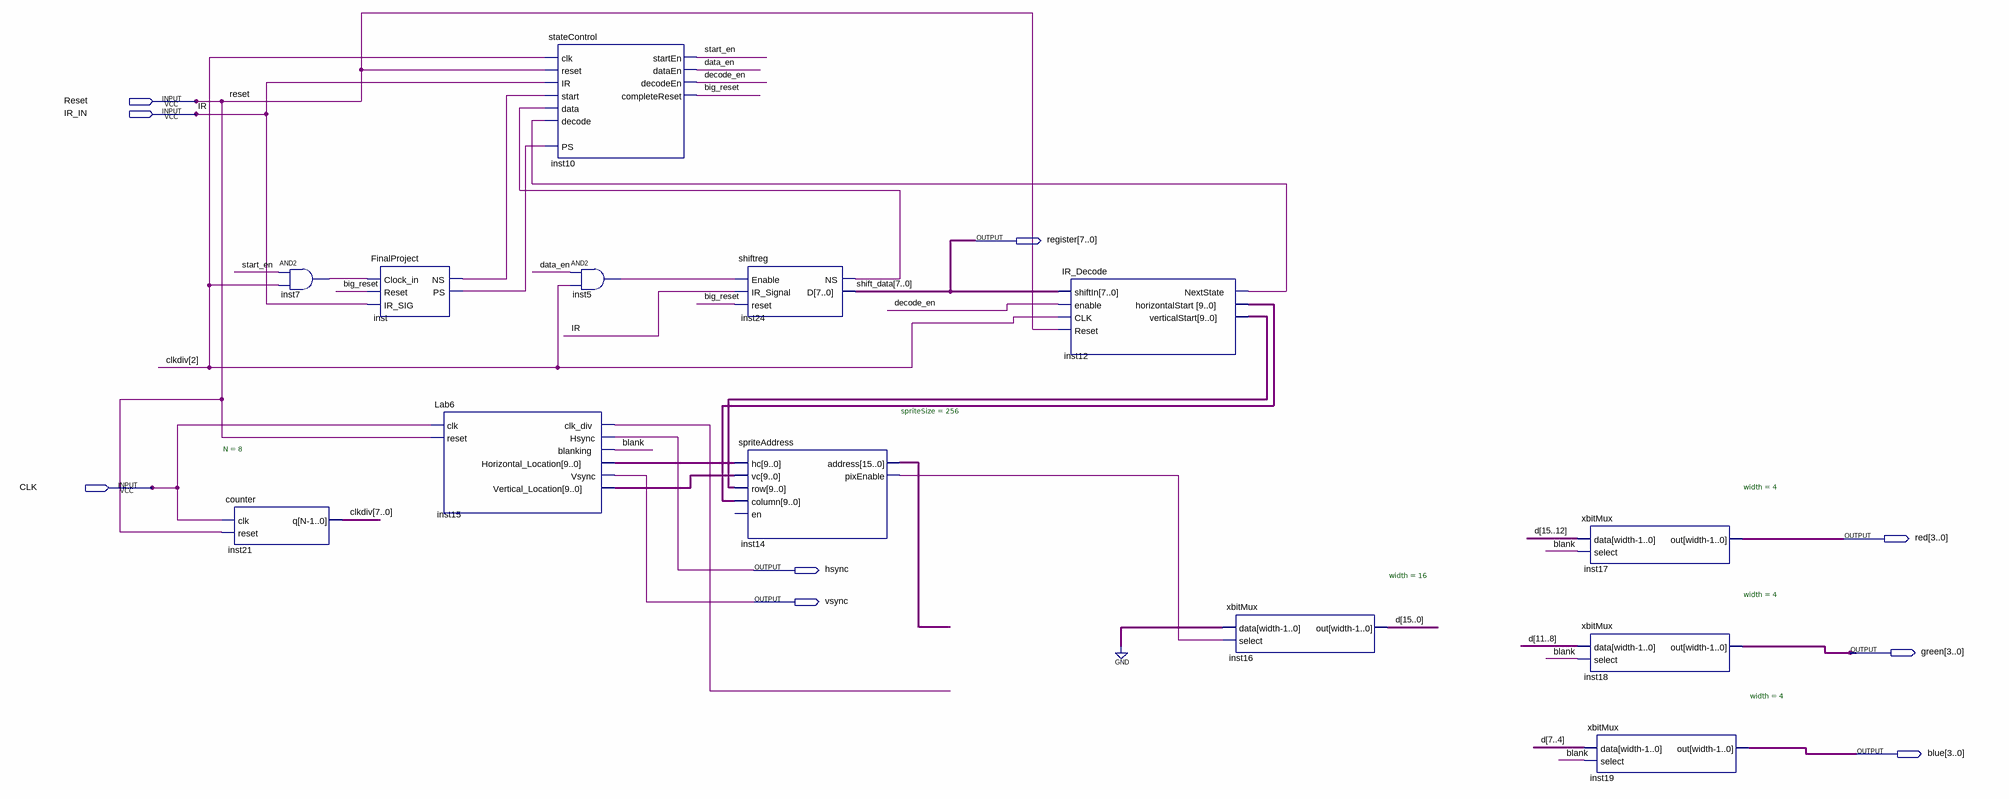
[diagram p0: schematic sheet]
// Quartus schematic test_bench.bdf as structural Verilog: 13 symbols, 9 pins
module test_bench (
  input  Reset,
  input  IR_IN,
  input  CLK,
  output [7:0] register,
  output [3:0] red,
  output hsync,
  output vsync,
  output [3:0] green,
  output [3:0] blue
);

  wire big_reset, blank, data_en, decode_en, inst5_out, inst7_out, inst12_nextstate, inst14_pixenable,
       inst15_clk_div, inst24_ns, inst_ns, inst_ps, start_en;
  wire [7:0] clkdiv;
  wire [9:0] inst12_horizontalstart, inst12_verticalstart, inst15_horizontal_location,
       inst15_vertical_location;
  wire [15:0] d, inst14_address;

  counter #(.N(8)) inst21 (.clk(CLK), .reset(Reset), .q(clkdiv));
  and inst7 (inst7_out, start_en, clkdiv[2]);
  FinalProject inst (.Clock_in(inst7_out), .Reset(big_reset), .IR_SIG(IR_IN), .NS(inst_ns), .PS(inst_ps));
  Lab6 inst15 (
    .clk(CLK), .reset(Reset), .clk_div(inst15_clk_div), .Hsync(hsync), .blanking(blank),
    .Horizontal_Location(inst15_horizontal_location), .Vsync(vsync),
    .Vertical_Location(inst15_vertical_location));
  stateControl inst10 (
    .clk(clkdiv[2]), .reset(Reset), .IR(IR_IN), .PS(inst_ps), .start(inst_ns), .data(inst24_ns),
    .decode(inst12_nextstate), .startEn(start_en), .dataEn(data_en), .decodeEn(decode_en),
    .completeReset(big_reset));
  and inst5 (inst5_out, data_en, clkdiv[2]);
  shiftreg inst24 (.Enable(inst5_out), .IR_Signal(IR_IN), .reset(big_reset), .NS(inst24_ns), .D(register));
  spriteAddress #(.spriteSize(256)) inst14 (
    .hc(inst15_horizontal_location), .vc(inst15_vertical_location), .row(inst12_verticalstart),
    .column(inst12_horizontalstart), .address(inst14_address), .pixEnable(inst14_pixenable));  // open: en
  IR_Decode inst12 (
    .shiftIn(register), .enable(decode_en), .CLK(clkdiv[2]), .Reset(Reset), .NextState(inst12_nextstate),
    .horizontalStart(inst12_horizontalstart), .verticalStart(inst12_verticalstart));
  xbitMux #(.width(16)) inst16 (.data({16{1'b0}}), .select(inst14_pixenable), .out(d));
  xbitMux #(.width(4)) inst17 (.data(d[15:12]), .select(blank), .out(red));
  xbitMux #(.width(4)) inst18 (.data(d[11:8]), .select(blank), .out(green));
  xbitMux #(.width(4)) inst19 (.data(d[7:4]), .select(blank), .out(blue));

  // Other names for the same wires on the sheet: IR = IR_IN; shift_data[7:0] = register
endmodule
